# EAGLE design mySatellite (EAGLE 6.6.0)
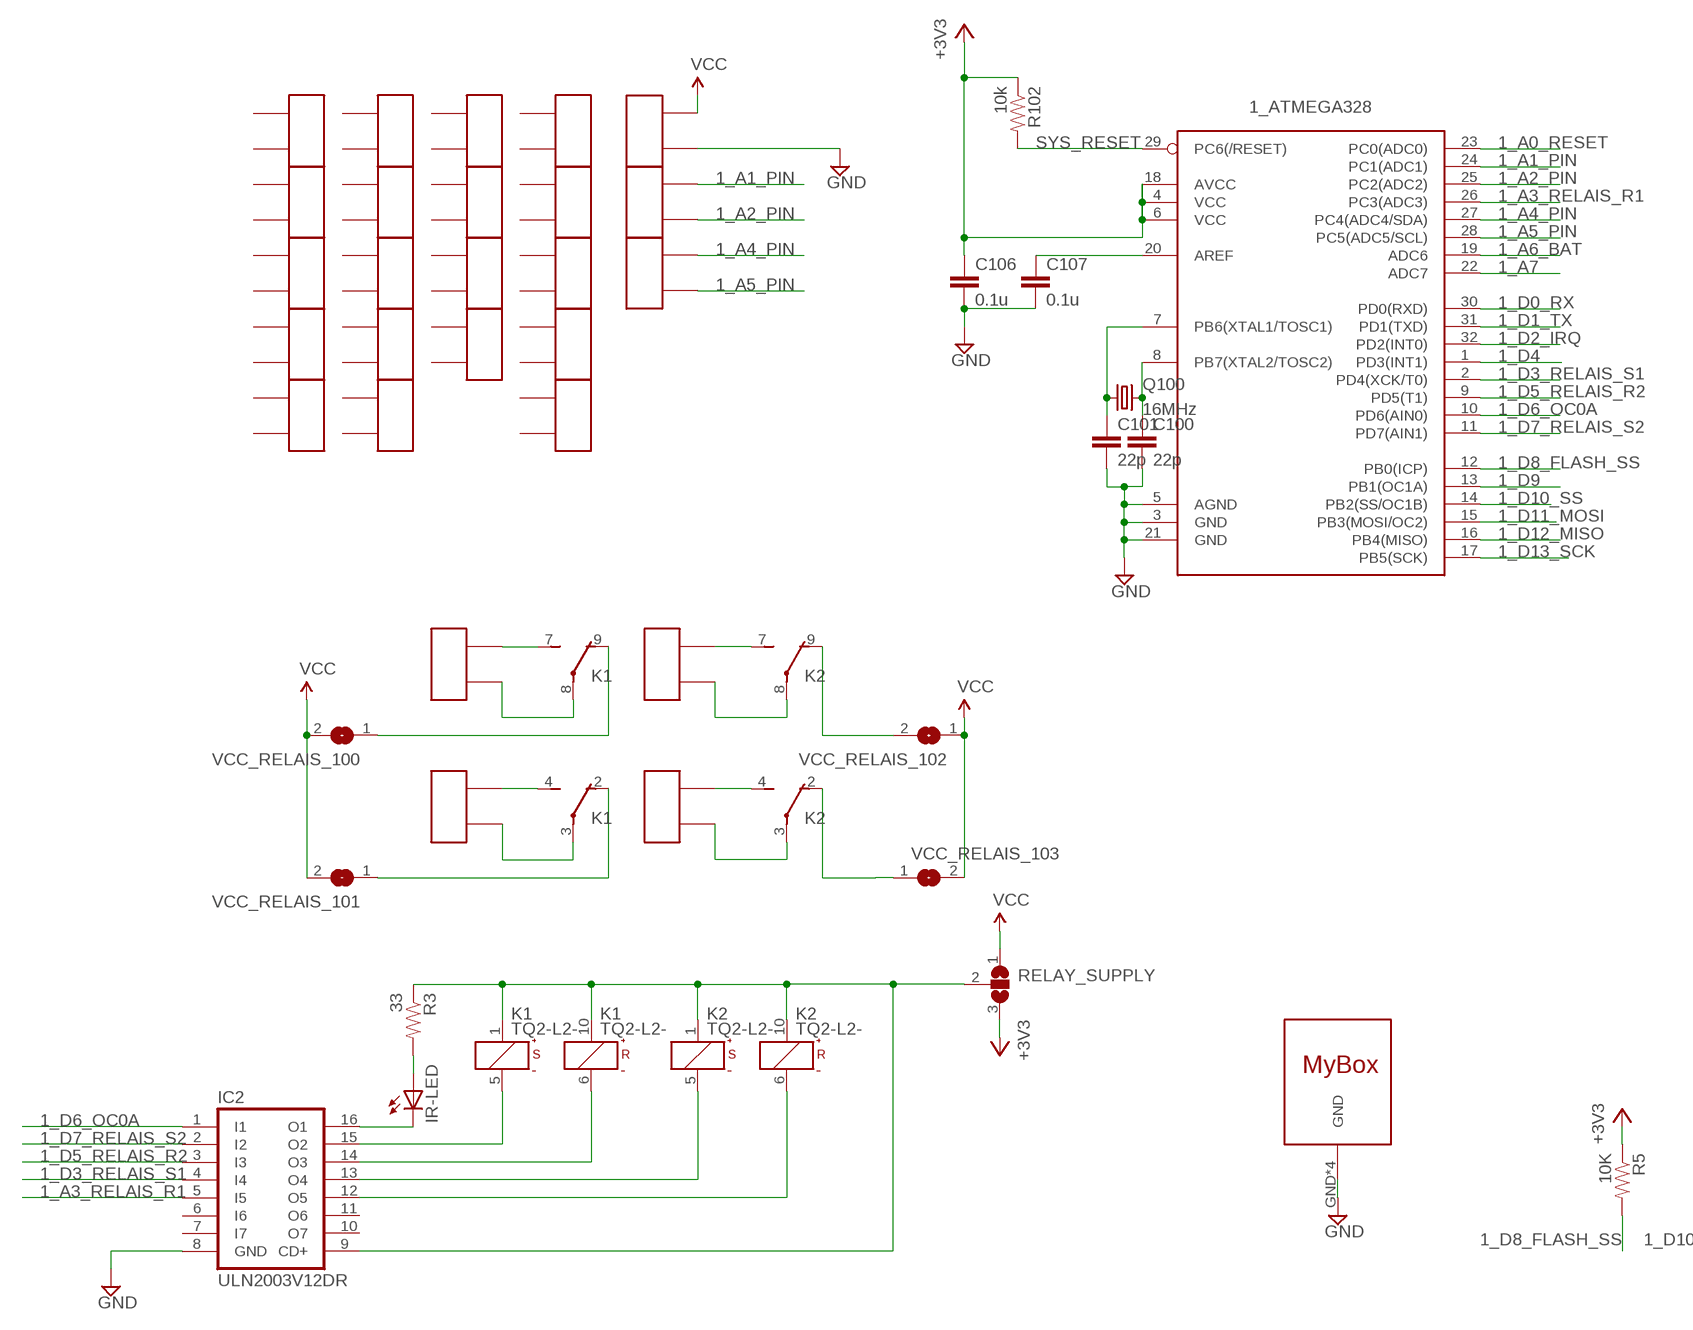
[diagram p0: schematic, sheet 1, part 1 of 2]
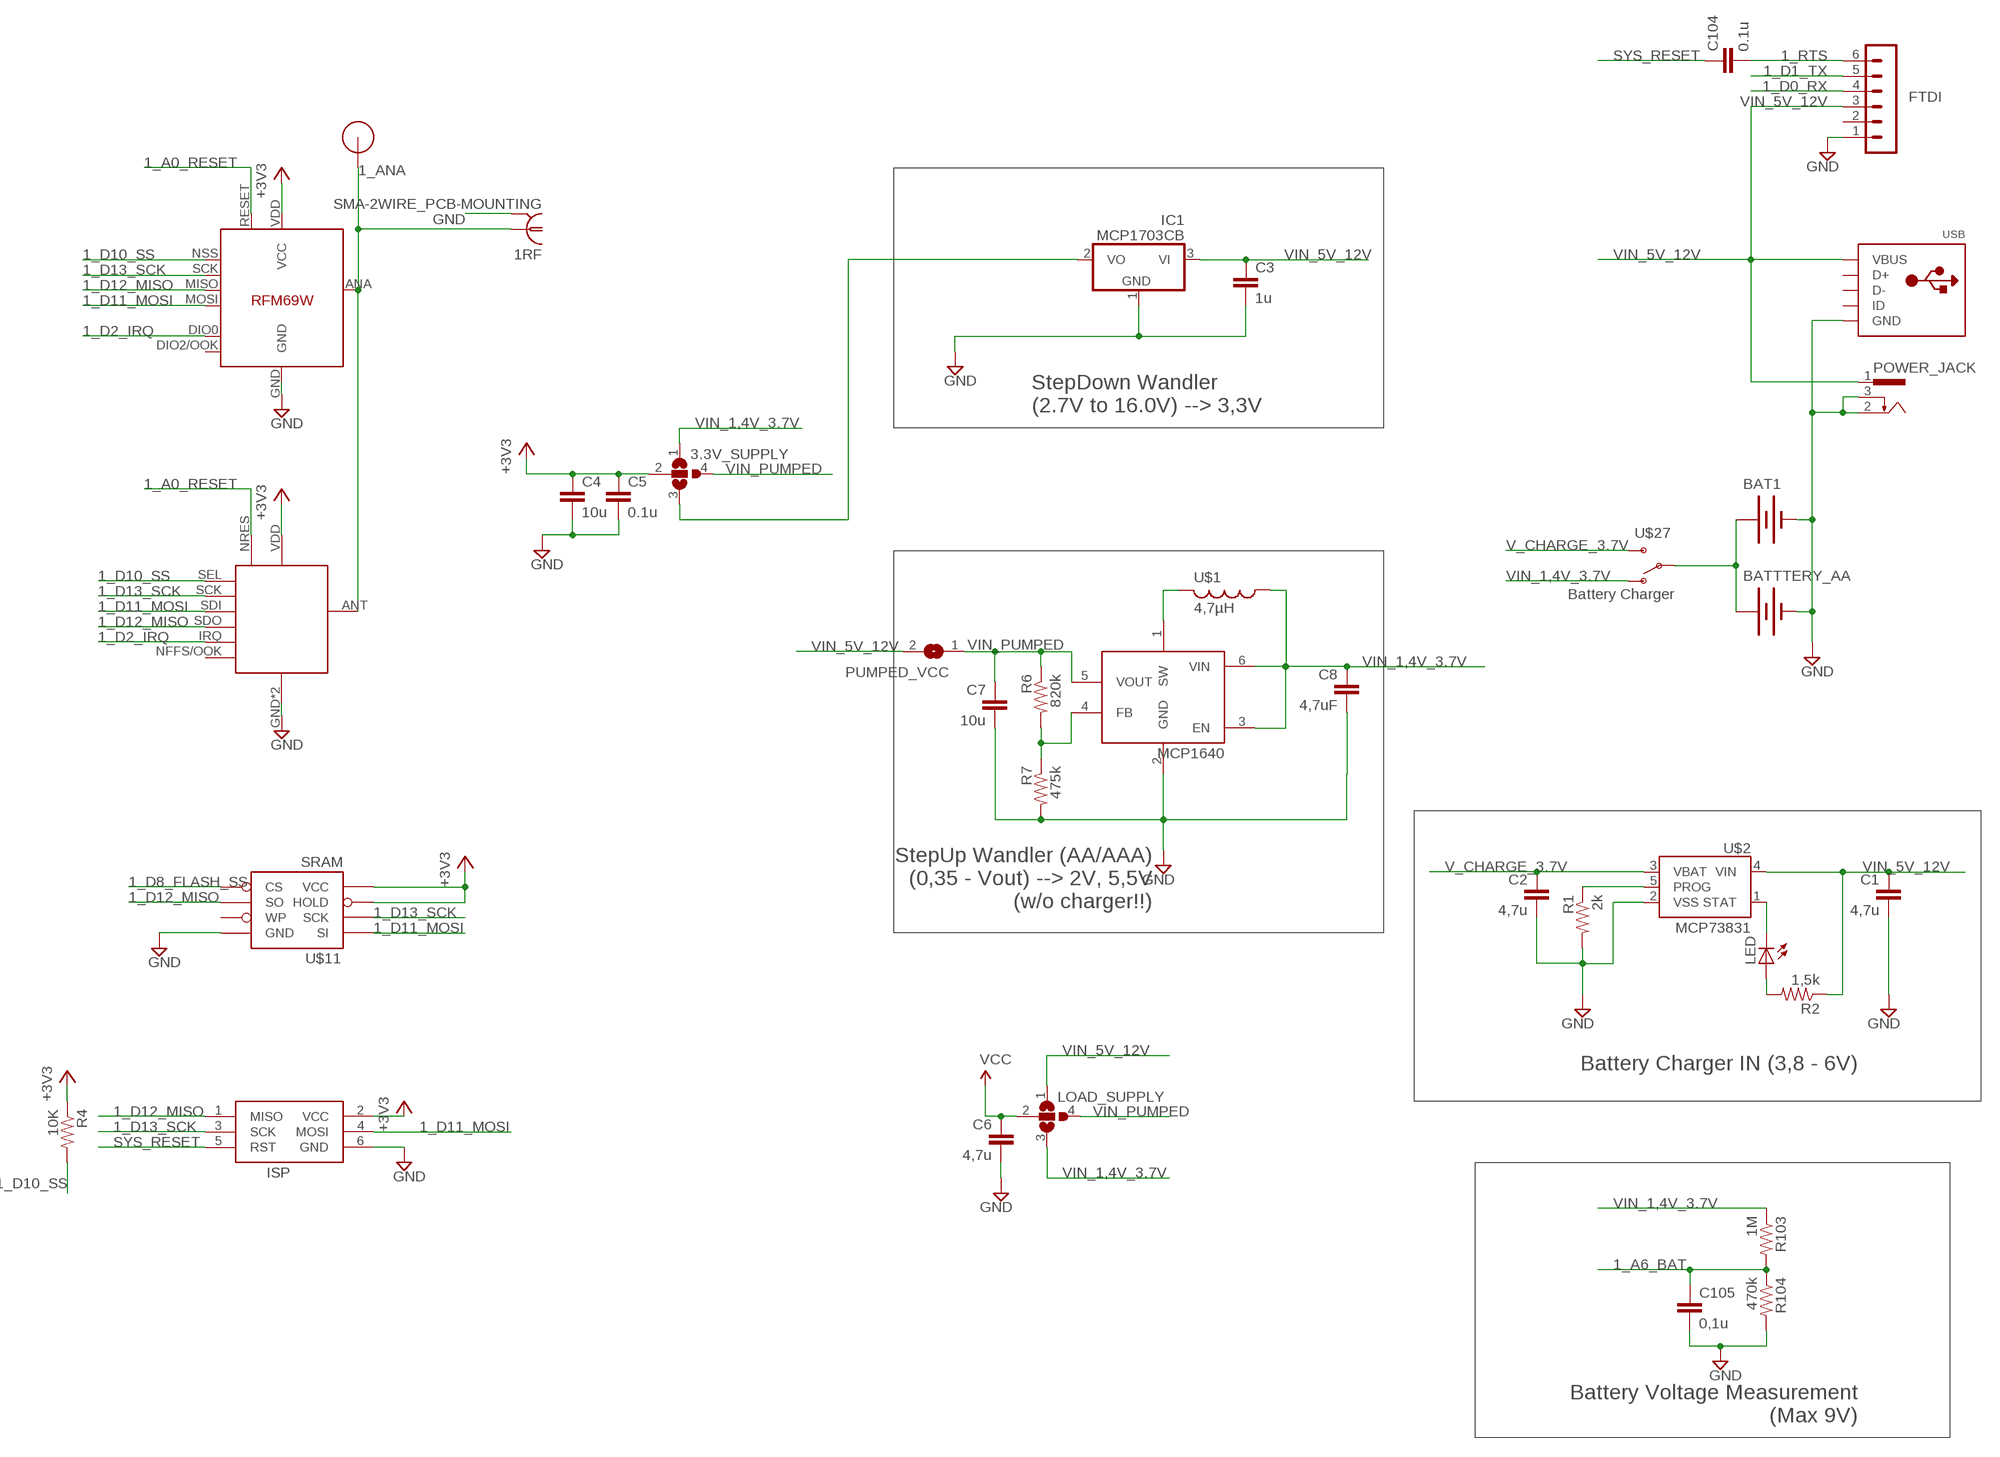
[diagram p1: schematic, sheet 1, part 2 of 2]

## Parts
1_ATMEGA328  ATMega-328  ATMEGA168/328TQFP32  [TQFP32-08]
1_RFM12  RFM12B_MINPADS  [RFM12B-MINPADS]
1_RFM69  RFM69_MINIPADS  [RFM69W-MINPADS]
1RF  SMA-2WIRE_PCB-MOUNTING  [J01151A0931]
3.3V_SUPPLY  SJ3W  [SJ_3]
ADC1  HDR_2PIN  [1X02_NS]
ADC2  HDR_2PIN  [1X02_NS]
BAT1  BATTERY  [BATTERY-CR2]
BATTTERY_AA  BATTERYAA  [BATTERY-AA]
C1  4,7u  CAP0603-CAP  [0603-CAP]
C2  4,7u  CAP0603-CAP  [0603-CAP]
C3  1u  CAP0603-CAP  [0603-CAP]
C4  10u  CAP0603-CAP  [0603-CAP]
C5  0.1u  CAP0603-CAP  [0603-CAP]
C6  4,7u  CAP0603-CAP  [0603-CAP]
C7  10u  CAP0603-CAP  [0603-CAP]
C8  4,7uF  CAP0603-CAP  [0603-CAP]
C100  22p  CAP0603-CAP  [0603-CAP]
C101  22p  CAP0603-CAP  [0603-CAP]
C104  0.1u  CAP0603-CAP  [0603-CAP]
C105  0,1u  CAP0603-CAP  [0603-CAP]
C106  0.1u  CAP0603-CAP  [0603-CAP]
C107  0.1u  CAP0603-CAP  [0603-CAP]
FTDI  FTDI  MA06-1  [MA06-1]
IC1  MCP1703CB  [SOT23]
IC2  ULN2003V12DR  ULN2003AD  [SO16]
IR-LED  LED5MM  [LED5MM]
IR/RELAY_SATELLITE  MY-BOX  [MY-BOX]
ISP  AVRISP  [AVRISP-EDGE]
K1  TQ2-L2-  [TQ2]
K2  TQ2-L2-  [TQ2]
LED  LED3MM  [LED3MM]
LOAD_SUPPLY  SJ3W  [SJ_3]
POWER_JACK  LUMBERG_1613-200-62  [733980-62]
PUMPED_VCC  SJ  [SJ]
Q100  16MHz  CRYSTALHC49S  [HC49/S]
R1  2k  RESISTOR0603-RES  [0603-RES]
R2  1,5k  RESISTOR0603-RES  [0603-RES]
R3  33  RESISTOR0603-RES  [0603-RES]
R4  10K  RESISTOR0603-RES  [0603-RES]
R5  10K  RESISTOR0603-RES  [0603-RES]
R6  820k  RESISTOR0603-RES  [0603-RES]
R7  475k  RESISTOR0603-RES  [0603-RES]
R102  10k  RESISTOR0603-RES  [0603-RES]
R103  1M  RESISTOR0603-RES  [0603-RES]
R104  470k  RESISTOR0603-RES  [0603-RES]
RELAY_SUPPLY  SJ2W  [SJ_2]
U1  MCP1640  [SOT23-6]
U$1  4,7µH  INDUCTOR_B82462G  [INDUCTOR_EPCOS]
U$2  MCP73831  [SOT23-5]
U$3  HDR_2PIN  [1X02_NS]
U$5  HDR_2PIN  [1X02_NS]
U$6  HDR_2PIN  [1X02_NS]
U$7  HDR_2PIN  [1X02_NS]
U$8  HDR_2PIN  [1X02_NS]
U$9  HDR_2PIN  [1X02_NS]
U$10  HDR_2PIN  [1X02_NS]
U$11  SRAM  SRAM_32K256JEDEC_3.9MM  [LOWPOWERLAB_SO08]
U$12  HDR_2PIN  [1X02_NS]
U$13  HDR_2PIN  [1X02_NS]
U$14  HDR_2PIN  [1X02_NS]
U$15  HDR_2PIN  [1X02_NS]
U$16  HDR_2PIN  [1X02_NS]
U$17  HDR_2PIN  [1X02_NS]
U$18  RFM12B_ANTENNA  [RFM12B-ANTENNA]
U$19  HDR_2PIN  [1X02_NS]
U$20  HDR_2PIN  [1X02_NS]
U$21  HDR_2PIN  [1X02_NS]
U$22  HDR_2PIN  [1X02_NS]
U$23  HDR_2PIN  [1X02_NS]
U$24  HDR_2PIN  [1X02_NS]
U$25  HDR_2PIN  [1X02_NS]
U$26  HDR_2PIN  [1X02_NS]
U$27  Battery Charger  SLIDE_SWITCH  [SSK-1202]
U$29  HDR_2PIN  [1X02_NS]
U$30  HDR_2PIN  [1X02_NS]
USB  USBMINIB  [USB-MINIB]
VCC  HDR_2PIN  [1X02_NS]
VCC_RELAIS_100  SJ  [SJ]
VCC_RELAIS_101  SJ  [SJ]
VCC_RELAIS_102  SJ  [SJ]
VCC_RELAIS_103  SJ  [SJ]

## Nets
1_A0_RESET: 1_ATMEGA328.23(PC0(ADC0)) 1_RFM12.NRES 1_RFM69.RESET
1_A1_PIN: 1_ATMEGA328.24(PC1(ADC1)) ADC1.1
1_A2_PIN: 1_ATMEGA328.25(PC2(ADC2)) ADC1.2
1_A3_RELAIS_R1: 1_ATMEGA328.26(PC3(ADC3)) IC2.5(I5)
1_A4_PIN: 1_ATMEGA328.27(PC4(ADC4/SDA)) ADC2.1
1_A5_PIN: 1_ATMEGA328.28(PC5(ADC5/SCL)) ADC2.2
1_A6_BAT: 1_ATMEGA328.19(ADC6) C105.1 R103.2 R104.1
1_A7: 1_ATMEGA328.22(ADC7)
1_ANA [ANT]: 1_RFM12.ANT 1_RFM69.ANA(ANT) 1RF.1 U$18.P$1
1_AREF: 1_ATMEGA328.20(AREF) C107.1
1_D0_RX: 1_ATMEGA328.30(PD0(RXD)) FTDI.4
1_D1_TX: 1_ATMEGA328.31(PD1(TXD)) FTDI.5
1_D2_IRQ: 1_ATMEGA328.32(PD2(INT0)) 1_RFM12.IRQ 1_RFM69.DIO0(DIO0/IRQ)
1_D3_RELAIS_S1: 1_ATMEGA328.2(PD4(XCK/T0)) IC2.4(I4)
1_D4: 1_ATMEGA328.1(PD3(INT1))
1_D5_RELAIS_R2: 1_ATMEGA328.9(PD5(T1)) IC2.3(I3)
1_D6_OC0A: 1_ATMEGA328.10(PD6(AIN0)) IC2.1(I1)
1_D7_RELAIS_S2: 1_ATMEGA328.11(PD7(AIN1)) IC2.2(I2)
1_D8_FLASH_SS: 1_ATMEGA328.12(PB0(ICP)) R5.2 U$11.1_CS(CS)
1_D9: 1_ATMEGA328.13(PB1(OC1A))
1_D10_SS: 1_ATMEGA328.14(PB2(SS/OC1B)) 1_RFM12.SEL 1_RFM69.NSS(SEL) R4.2
1_D11_MOSI: 1_ATMEGA328.15(PB3(MOSI/OC2)) 1_RFM12.SDI(SDI/MOSI) 1_RFM69.MOSI ISP.4(MOSI) U$11.5_SI(SI)
1_D12_MISO: 1_ATMEGA328.16(PB4(MISO)) 1_RFM12.SDO(SDO/MISO) 1_RFM69.MISO ISP.1(MISO) U$11.2_SO(SO)
1_D13_SCK: 1_ATMEGA328.17(PB5(SCK)) 1_RFM12.SCK 1_RFM69.SCK ISP.3(SCK) U$11.6_SCK(SCK)
1_RTS: C104.2 FTDI.6
+3V3 [power]: 1_ATMEGA328.4(VCC) 1_ATMEGA328.6(VCC) 1_ATMEGA328.18(AVCC) 1_RFM12.VDD 1_RFM69.VDD(VCC) 3.3V_SUPPLY.2 C4.1 C5.1 C106.1 ISP.2(VCC) R4.1 R5.1 R102.1 RELAY_SUPPLY.3 U$11.7_HOLD(HOLD) U$11.8_VCC(VCC)
BAT+ [power]: BAT1.PWR@1(+) BATTTERY_AA.PWR@1(+) U$27.P
GND [power]: 1_ATMEGA328.3(GND) 1_ATMEGA328.5(AGND) 1_ATMEGA328.21(GND) 1_RFM12.GND 1_RFM12.GND1(GND) 1_RFM69.GND 1RF.G@1 1RF.G@2 1RF.G@3 1RF.G@4 BAT1.GND@1(-) BATTTERY_AA.GND@1(-) C1.2 C2.2 C3.2 C4.2 C5.2 C6.2 C7.2 C8.2 C100.2 C101.2 C105.2 C106.2 C107.2 FTDI.1 IC1.1(GND) IC2.8(GND) IR/RELAY_SATELLITE.GND IR/RELAY_SATELLITE.GND1(GND) IR/RELAY_SATELLITE.GND2(GND) IR/RELAY_SATELLITE.GND3(GND) ISP.6(GND) POWER_JACK.2 POWER_JACK.3 R1.2 R7.2 R104.2 U1.2(GND) U$2.2(VSS) U$11.4_GND(GND) USB.GND VCC.2
N$1: 1_ATMEGA328.7(PB6(XTAL1/TOSC1)) C101.1 Q100.1
N$2: R1.1 U$2.5(PROG)
N$3 [power]: IR-LED.A R3.2
N$4 [power]: IC2.16(O1) IR-LED.K(C)
N$5 [power]: IC2.15(O2) K1.5(S:-)
N$6 [power]: IC2.14(O3) K1.6(R:-)
N$7: 1_ATMEGA328.8(PB7(XTAL2/TOSC2)) C100.1 Q100.2
N$8: LED.K(C) U$2.1(STAT)
N$9 [power]: 3.3V_SUPPLY.3 IC1.2(VO)
N$10 [high_power]: K2.3(1:P) U$24.1
N$11: LED.A R2.2
N$12 [high_power]: K1.4(1:S) U$22.2
N$13 [high_power]: K1.8(2:P) U$21.1
N$14 [high_power]: K1.7(2:S) U$21.2
N$15 [power]: IC2.13(O4) K2.5(S:-)
N$16 [power]: IC2.12(O5) K2.6(R:-)
N$17 [high_power]: K2.8(2:P) U$23.1
N$18 [high_power]: K2.4(1:S) U$24.2
N$19 [high_power]: K2.7(2:S) U$23.2
N$20 [high_power]: K1.3(1:P) U$22.1
N$21 [high_power]: K1.2(1:O) VCC_RELAIS_101.1
N$23 [power]: IC2.9(CD+) K1.1(S:+) K1.10(R:+) K2.1(S:+) K2.10(R:+) R3.1 RELAY_SUPPLY.2
N$24 [high_power]: K2.2(1:O) VCC_RELAIS_103.1
N$25 [high_power]: K1.9(2:O) VCC_RELAIS_100.1
N$26 [high_power]: K2.9(2:O) VCC_RELAIS_102.2
N$27 [power]: U1.1(SW) U$1.P$2
N$29 [power]: R6.2 R7.1 U1.4(FB)
SYS_RESET: 1_ATMEGA328.29(PC6(/RESET)) C104.1 ISP.5(RST) R102.2
V_CHARGE_3.7V [power]: C2.1 U$2.3(VBAT) U$27.S
VCC [high_power]: C6.1 LOAD_SUPPLY.2 RELAY_SUPPLY.1 VCC.1 VCC_RELAIS_100.2 VCC_RELAIS_101.2 VCC_RELAIS_102.1 VCC_RELAIS_103.2
VIN_1,4V_3.7V [power]: 3.3V_SUPPLY.1 C8.1 LOAD_SUPPLY.3 R103.1 U1.3(EN) U1.6(VIN) U$1.P$1 U$27.O
VIN_5V_12V [high_power]: C1.1 C3.1 FTDI.3 IC1.3(VI) LOAD_SUPPLY.1 POWER_JACK.1 PUMPED_VCC.2 R2.1 U$2.4(VIN) USB.VBUS
VIN_PUMPED [power]: 3.3V_SUPPLY.4 C7.1 LOAD_SUPPLY.4 PUMPED_VCC.1 R6.1 U1.5(VOUT)
Unconnected: 1_RFM12.NFFS/OOK 1_RFM69.DIO2/OOK FTDI.2 IC2.6(I6) IC2.7(I7) IC2.10(O7) IC2.11(O6) U$3.1 U$3.2 U$5.1 U$5.2 U$6.1 U$6.2 U$7.1 U$7.2 U$8.1 U$8.2 U$9.1 U$9.2 U$10.1 U$10.2 U$11.3_WP(WP) U$12.1 U$12.2 U$13.1 U$13.2 U$14.1 U$14.2 U$15.1 U$15.2 U$16.1 U$16.2 U$17.1 U$17.2 U$19.1 U$19.2 U$20.1 U$20.2 U$25.1 U$25.2 U$26.1 U$26.2 U$29.1 U$29.2 U$30.1 U$30.2 USB.D+ USB.D- USB.ID

## Notes on the sheet
- StepDown Wandler 
  (2.7V to 16.0V) --> 3,3V
- StepUp Wandler (AA/AAA)
  (0,35 - Vout) --> 2V, 5,5V
  (w/o charger!!)
- Battery Charger IN (3,8 - 6V)
- Battery Voltage Measurement
  (Max 9V)

## Library data of the parts
1_ATMEGA328 = myLib:ATMEGA168/328: Atmel 32-pin 8-bit micro, 16k flash.; BUERKLIN: 64 S 3046; CONRAD: 155196 - 62
1_RFM12 = myLib:RFM12B_MINPADS
1_RFM69 = myLib:RFM69_MINIPADS
1RF = myLib:SMA-2WIRE_PCB-MOUNTING: SMA 50 Ohm Straight Jack Receptacle - PCB Mountung www.telegaertner.de Source: Buerklin Artikelnummer: J01151A0931; BUERKLIN: 76F410
3.3V_SUPPLY LOAD_SUPPLY = myLib:SJ3W: SMD solder JUMPER
ADC1 ADC2 U$3 U$5-U$10 U$12-U$17 U$19-U$26 U$29 U$30 VCC = myLib:HDR_2PIN
BAT1 = myLib:BATTERY: Battery Holders Various common sizes : AA, AAA, 20mm coin cell and 12mm coin cell.
BATTTERY_AA = myLib:BATTERY: Battery Holders Various common sizes : AA, AAA, 20mm coin cell and 12mm coin cell.; CONRAD: 651036 - 62
C1 C2 C8 = LowPowerLab:CAP: Capacitor Standard 0603 ceramic capacitor, and 0.1" leaded capacitor.; BUERKLIN: 53 D 2086
C3 = LowPowerLab:CAP: Capacitor Standard 0603 ceramic capacitor, and 0.1" leaded capacitor.; BUERKLIN: 53 D 2082
C4 C7 = LowPowerLab:CAP: Capacitor Standard 0603 ceramic capacitor, and 0.1" leaded capacitor.; BUERKLIN: 53 D 1652
C5 C104-C107 = LowPowerLab:CAP: Capacitor Standard 0603 ceramic capacitor, and 0.1" leaded capacitor.; BUERKLIN: 53 D 1726
C6 = LowPowerLab:CAP: Capacitor Standard 0603 ceramic capacitor, and 0.1" leaded capacitor.; BUERKLIN: 53 D 1659
C100 C101 = LowPowerLab:CAP: Capacitor Standard 0603 ceramic capacitor, and 0.1" leaded capacitor.; BUERKLIN: 53 D 1676
FTDI = JeeLabs:MA06-1: PIN HEADER; BUERKLIN: 59 F 2134
IC1 = linear:MCP1703: 250 mA, 16V, Low Quiescent Current LDO Regulator Source: http://ww1.microchip.com/downloads/en/DeviceDoc/22049b.pdf; CONRAD: 651422 - 62
IC2 = uln-udn:ULN2003A: DRIVER ARRAY; CONRAD: 1187534 - 62
IR-LED = led:LED: LED; BUERKLIN: 65 S 2292
IR/RELAY_SATELLITE = myLib:MY-BOX; CONRAD: 522651
ISP = myLib:AVRISP: AVR ISP HEADER Standard 6 pin header for AVR programming; BUERKLIN: 56F6228; CONRAD: 737480-62
K1 K2 = relay:TQ2?-L2-*: LOW PROFILE 2 FORM C RELAY NAiS 2 coil latching Source: http://www.mew-europe.com/.. en_ds_61020_0001.pdf Source: http://www.mew-europe.com/.. en_ds_61020_0002.pdf; BUERKLIN: 30 G 7570; MF: AROMAT/ MATSUSHITA; MPN: TQ2-L2-3V; OC_FARNELL: 1217662; OC_NEWARK: 64K3196
LED = adafruit:LED: LED; CONRAD: 1050451 - 62
POWER_JACK = myLib:LUMBERG_1613-20: FEMALE PRINT CONNECTOR Niedervolt-Steckverbinder Distributor Conrad; BUERKLIN: 40 F 144
PUMPED_VCC VCC_RELAIS_100-VCC_RELAIS_103 = jumper:SJ: SMD solder JUMPER
Q100 = crystal:CRYSTAL: CRYSTAL; BUERKLIN: 78D428; OC_FARNELL: 1667008; OC_NEWARK: unknown
R1 = LowPowerLab:RESISTOR: Resistor Basic schematic elements and footprints for 0603, 1206, and PTH resistors.; BUERKLIN: 26 E 7099
R2 = LowPowerLab:RESISTOR: Resistor Basic schematic elements and footprints for 0603, 1206, and PTH resistors.; BUERKLIN: 26 E 796
R3 = LowPowerLab:RESISTOR: Resistor Basic schematic elements and footprints for 0603, 1206, and PTH resistors.; BUERKLIN: 26 E 756
R4 R5 R102 = LowPowerLab:RESISTOR: Resistor Basic schematic elements and footprints for 0603, 1206, and PTH resistors.; BUERKLIN: 26 E 816
R6 = LowPowerLab:RESISTOR: Resistor Basic schematic elements and footprints for 0603, 1206, and PTH resistors.; BUERKLIN: 26 E 862
R7 = LowPowerLab:RESISTOR: Resistor Basic schematic elements and footprints for 0603, 1206, and PTH resistors.; BUERKLIN: 26 E 7201
R103 = LowPowerLab:RESISTOR: Resistor Basic schematic elements and footprints for 0603, 1206, and PTH resistors.; BUERKLIN: 26 E 864
R104 = LowPowerLab:RESISTOR: Resistor Basic schematic elements and footprints for 0603, 1206, and PTH resistors.; BUERKLIN: 26 E 856
RELAY_SUPPLY = myLib:SJ2W: SMD solder JUMPER
U1 = myLib:MCP1640: MCP1623, 1624, 1640/B/C/D pwm/pfm or pwm only DC/DC converters, in SOT-23; CONRAD-MCP1640C: 651406 - 62
U$1 = myLib:INDUCTOR; BUERKLIN_EPCOS: 73 D 9010
U$2 = myLib:MCP73831: Microchip's MCP73831 Miniature single cell, fully integrated Li-Ion, Li-polymer charge management controller http://ww1.microchip.com/downloads/en/DeviceDoc/21984a.pdf; CONRAD: 651522 - 62
U$11 = myLib:SRAM_32K256: 4-Mbit SPI flash memory; CONRAD: 651216 - 62
U$18 = LowPowerLab:RFM12B_ANTENNA
U$27 = myLib:SLIDE_SWITCH: Side-actuated SPDT slide switch, as used on the Arduino Pro; CONRAD: 709774 - 62
USB = myLib:USB: USB Connectors USBMINIB - Surface Mount Female Mini-B USB Connector 4UConnector: 06564 By microbuilder.eu Thru-hole RA Female Mini-B USB Connector 4UConnector: 18732 By ladyada.net; BUERKLIN: 72 F 2280

## Net classes
1 power: width 0.356 mm, clearance 0.229 mm
2 ANT: width 0.381 mm, clearance 0.254 mm
3 high_power: width 0.508 mm, clearance 0.381 mm

## Board
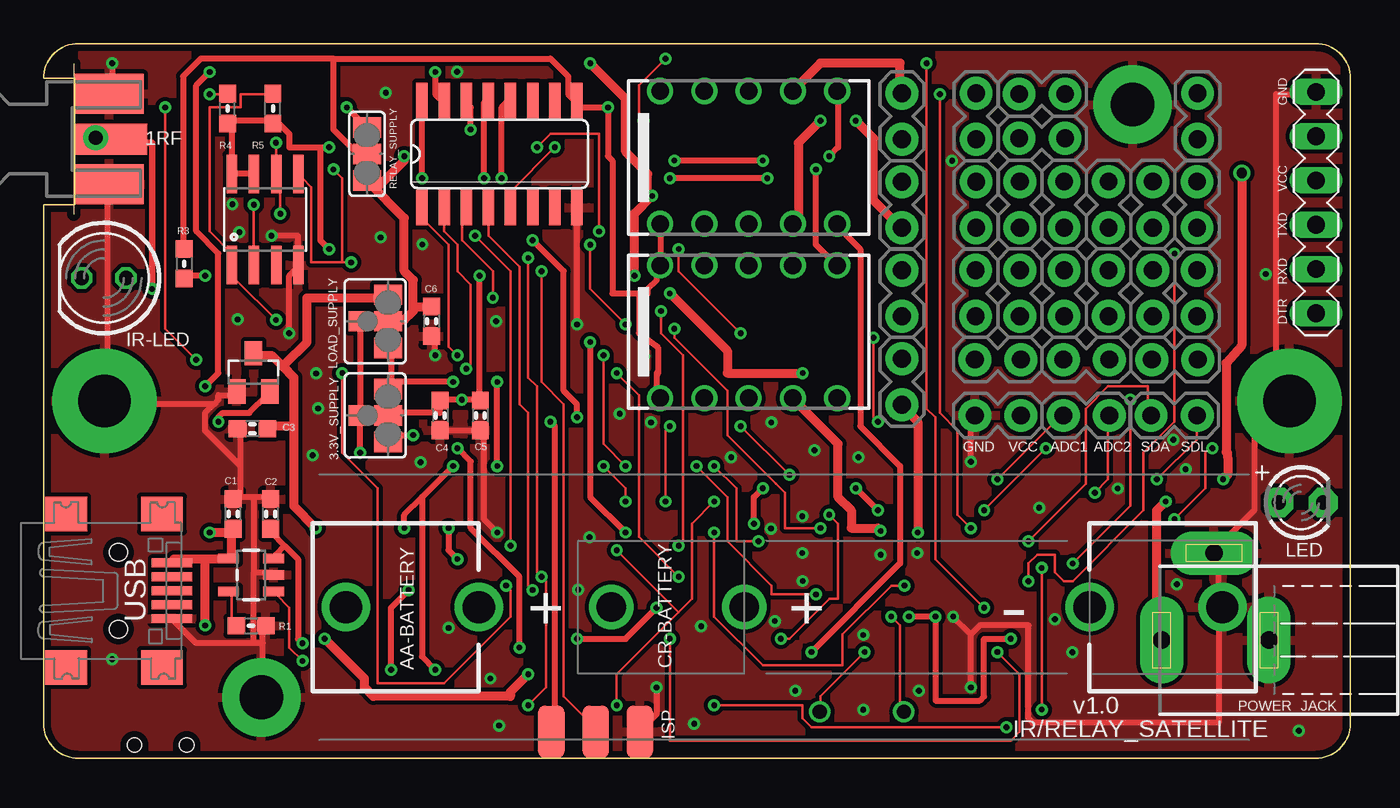
[diagram p2: board, top side]
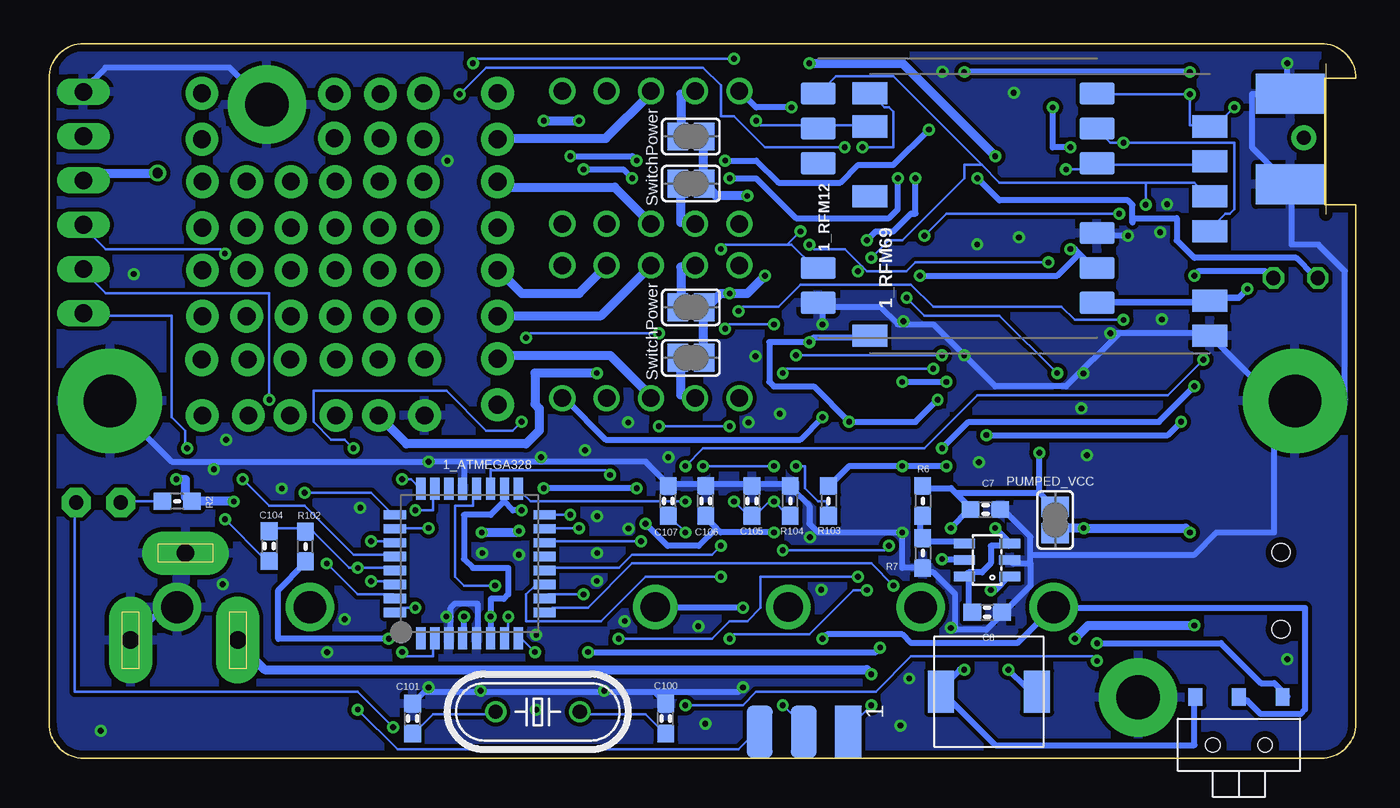
[diagram p3: board, bottom side, seen from below]

Size 75 x 41 mm. Coordinates in mm from the lower left corner, seen from the top.
Copper layers (1*16): Top 0.0356mm / dielectric 1.5011mm / Bottom 0.0356mm
Design rules "LaenPCBOrder": minimum track width 6mil, minimum drill 13mil, track to track 6mil, track to pad 6mil, pad to pad 6mil, via to via 6mil, smd to smd 6mil, copper to edge 15mil, drill to drill 6mil, minimum pad ring 7mil, minimum via ring 7mil, stop-mask expansion 3mil, vias tented up to drill 0mil, thermal gap 10mil

### Footprints (pad centres in the part's own frame; a part is rotated, then mirrored left to right if it is on the bottom)
TQFP32-08 = smd 1.27 x 0.533: 1 -4.293,2.8; 2 -4.293,2; 3 -4.293,1.2; 4 -4.293,0.4; 5 -4.293,-0.4; 6 -4.293,-1.2; 7 -4.293,-2; 8 -4.293,-2.8; 17 4.293,-2.8; 18 4.293,-2; 19 4.293,-1.2; 20 4.293,-0.4; 21 4.293,0.4; 22 4.293,1.2; 23 4.293,2; 24 4.293,2.8 | smd 0.533 x 1.27: 9 -2.8,-4.293; 10 -2,-4.293; 11 -1.2,-4.293; 12 -0.4,-4.293; 13 0.4,-4.293; 14 1.2,-4.293; 15 2,-4.293; 16 2.8,-4.293; 25 2.8,4.293; 26 2,4.293; 27 1.2,4.293; 28 0.4,4.293; 29 -0.4,4.293; 30 -1.2,4.293; 31 -2,4.293; 32 -2.8,4.293
RFM12B-MINPADS = smd 2 x 1.27: ANT 8,-6; GND 8,-2; GND1 -8.002,-6.001; IRQ -8,4; NFFS/OOK -8,2; NRES -8.002,-4; SCK 8,4; SDI 8,2; SDO -8,6; SEL 8,6; VDD 8,-4
RFM69W-MINPADS = smd 2 x 1.27: ANA 8,-5; DIO0 -11.5,5; DIO2/OOK -11.5,1; GND 8,-7; MISO 8,1; MOSI 8,3; NSS 8,5; RESET -11.5,6.909; SCK 8,-1; VDD -11.5,-7
J01151A0931 = smd 4.191 x 1.778: 1 2.134,0 | smd 3.937 x 2.286: G@1 2.032,2.6; G@2 2.032,-2.6 | smd 3.937 x 2.286 bottom: G@3 2.032,2.6; G@4 2.032,-2.6
SJ_3 = smd 1.168 x 1.6: 1 -1.524,0; 2 0,0; 3 1.524,0 | smd 1.168 x 1.168: 4 0,-1.67
1X02_NS = drill 1.016 pad 1.88: 1 -1.321,0; 2 1.321,0
BATTERY-CR2 = drill 1.702: GND@1 17.272,0; GND@2 9.652,0; PWR@1 -10.16,0; PWR@2 -17.78,0
BATTERY-AA = drill 1.854: GND@1 25.146,0; GND@2 17.526,0; PWR@1 -25.146,0; PWR@2 -17.526,0
0603-CAP = smd 1.016 x 0.965: 1 -0.85,0; 2 0.85,0
MA06-1 = drill 1.016 long: 1 0,0; 2 2.54,0; 3 5.08,0; 4 7.62,0; 5 10.16,0; 6 12.7,0
SOT23 = smd 1 x 1.4: 1 -0.95,-1.1; 2 0.95,-1.1; 3 0,1.1
SO16 = smd 0.66 x 2.032: 1 -4.445,-3.073; 2 -3.175,-3.073; 3 -1.905,-3.073; 4 -0.635,-3.073; 5 0.635,-3.073; 6 1.905,-3.073; 7 3.175,-3.073; 8 4.445,-3.073; 9 4.445,3.073; 10 3.175,3.073; 11 1.905,3.073; 12 0.635,3.073; 13 -0.635,3.073; 14 -1.905,3.073; 15 -3.175,3.073; 16 -4.445,3.073
LED5MM = drill 0.813 octagon: A -1.27,0; K 1.27,0
MY-BOX = drill 2.5 pad 4.5: GND 12.5,3.5; GND1 62.5,37.5 | drill 3 pad 6: GND2 3.5,20.5; GND3 71.5,20.5
AVRISP-EDGE = smd 3 x 1.5: 1 1.5,2.54; 3 1.5,0; 5 1.5,-2.54 | smd 3 x 1.5 bottom: 2 1.5,2.54; 4 1.5,0; 6 1.5,-2.54
TQ2 = drill 1: 1 -5.08,-3.81; 2 -2.54,-3.81; 3 0,-3.81; 4 2.54,-3.81; 5 5.08,-3.81; 6 5.08,3.81; 7 2.54,3.81; 8 0,3.81; 9 -2.54,3.81; 10 -5.08,3.81
LED3MM = drill 0.813 pad 1.676 octagon: A -1.27,0; K 1.27,0
733980-62 = drill 1 pad 2.5 long: 1 0,8.57; 2 0,2.42; 3 5,5.57
SJ = smd 1.168 x 1.6: 1 -0.762,0; 2 0.762,0
HC49/S = drill 0.813: 1 -2.413,0; 2 2.413,0
0603-RES = smd 1.016 x 0.965: 1 -0.85,0; 2 0.85,0
SJ_2 = smd 1.168 x 1.6: 1 -1.524,0; 2 0,0; 3 1.524,0
SOT23-6 = smd 0.55 x 1.2: 1 -0.95,-1.3; 2 0,-1.3; 3 0.95,-1.3; 4 0.95,1.3; 5 0,1.3; 6 -0.95,1.3
INDUCTOR_EPCOS = smd 1.5 x 2.4: P$1 -2.75,3.15; P$2 2.75,3.15
SOT23-5 = smd 0.55 x 1.2: 1 -0.95,-1.3; 2 0,-1.3; 3 0.95,-1.3; 4 0.95,1.3; 5 -0.95,1.3
LOWPOWERLAB_SO08 = smd 0.61 x 2.21: 1_CS -1.905,-2.616; 2_SO -0.635,-2.616; 3_WP 0.635,-2.616; 4_GND 1.905,-2.616; 5_SI 1.905,2.616; 6_SCK 0.635,2.616; 7_HOLD -0.635,2.616; 8_VCC -1.905,2.616
RFM12B-ANTENNA = drill 0.8 pad 1.422: P$1 0,0
SSK-1202 = smd 0.8 x 1: O -2.5,2.75; P 0,2.75; S 2.5,2.75 | hole 0.8: -1.5,0; 1.5,0
USB-MINIB = smd 0.5 x 2.308: D+ 0,4.064; D- -0.8,4.064; GND 1.6,4.064; ID 0.8,4.064; VBUS -1.6,4.064 | smd 2 x 2.4: GND1 -4.4,-2; GND2 -4.4,3.5; GND3 4.4,3.5; GND4 4.4,-2 | hole 1: -2.2,1; 2.2,1

### Placement (x,y rotation side)
1_ATMEGA328  50.86,11.17 90 bottom
1_RFM12  22.86,32.13 0 bottom
1_RFM69  16.38,31.24 0 bottom
1RF  1.73,35.52 0 top
3.3V_SUPPLY  19.76,19.67 270 top
ADC1  59.84,19.67 0 top
ADC2  64.88,19.67 0 top
BAT1  50.36,8.67 0 top
BATTTERY_AA  42.5,8.67 0 top
C1  10.88,14.02 90 top
C2  13.03,14.02 90 top
C3  11.99,18.91 180 top
C4  22.76,19.67 270 top
C5  25.06,19.67 270 top
C6  22.26,25.07 270 top
C7  21.26,14.27 0 bottom
C8  21.16,8.37 0 bottom
C100  39.61,2.27 90 bottom
C101  54.13,2.27 90 bottom
C104  62.36,12.17 270 bottom
C105  34.66,14.77 90 bottom
C106  37.31,14.77 90 bottom
C107  39.46,14.77 90 bottom
FTDI  73.02,38.23 270 top
IC1  12.04,22.13 0 top
IC2  26.16,34.67 0 top
IR-LED  3.46,27.55 180 top
IR/RELAY_SATELLITE  0,0 0 top
ISP  31.68,3.03 270 bottom
K1  40.46,34.47 0 top
K2  40.46,24.47 0 top
LED  72.16,14.67 0 top
LOAD_SUPPLY  19.76,25.07 270 top
POWER_JACK  72.74,6.78 90 top
PUMPED_VCC  17.26,13.67 270 bottom
Q100  46.95,2.67 0 bottom
R1  11.91,7.59 0 top
R2  67.64,14.74 180 bottom
R3  8.06,28.37 270 top
R4  10.56,37.27 90 top
R5  13.16,37.27 90 top
R6  24.86,14.77 270 bottom
R7  24.86,11.77 270 bottom
R102  60.28,12.15 90 bottom
R103  30.26,14.77 270 bottom
R104  32.46,14.77 90 bottom
RELAY_SUPPLY  18.56,34.67 90 top
U1  21.16,11.37 90 bottom
U$1  21.06,0.67 0 bottom
U$2  11.91,10.52 90 top
U$3  59.84,22.87 180 top
U$5  56.03,26.68 270 top
U$6  58.57,26.68 270 top
U$7  61.11,26.68 270 top
U$8  63.65,26.68 270 top
U$9  66.19,26.68 270 top
U$10  53.49,26.68 270 top
U$11  12.72,30.91 0 top
U$12  56.03,31.76 270 top
U$13  58.57,31.76 270 top
U$14  61.11,31.76 270 top
U$15  63.65,31.76 270 top
U$16  66.19,31.76 270 top
U$17  53.52,31.75 270 top
U$18  3,35.6 0 top
U$19  57.3,35.57 180 top
U$20  64.92,22.87 180 top
U$21  49.26,36.83 90 top
U$22  49.26,31.75 270 top
U$23  49.26,26.68 90 top
U$24  49.26,21.6 270 top
U$25  57.3,38.11 180 top
U$26  54.76,22.87 180 top
U$27  6.71,0.77 0 bottom
U$29  66.22,36.83 90 top
U$30  53.52,36.83 90 top
USB  3.3,9.61 270 top
VCC  54.76,19.67 180 top
VCC_RELAIS_100  38.16,35.67 0 bottom
VCC_RELAIS_101  38.16,32.97 0 bottom
VCC_RELAIS_102  38.16,25.87 180 bottom
VCC_RELAIS_103  38.16,22.97 0 bottom

### Tracks (layer width: path | path; a pad name or v marks a point on that pad's centre or on a via)
1_A0_RESET  (via drill 0.33)
  Top 0.152: v57.53,17.78 v53.98,14.22 | v47.88,19.3 47.62,19.56 v47.62,24.13 | v40.01,24.38 36.45,27.94 v36.45,29.21 | v28.32,35.05 29.08,35.81 31.88,35.81 v31.88,30.23
  Bottom 0.152: v53.98,14.22 52.96,14.22 52.96,15.24 1_ATMEGA328.23 | v57.53,17.78 58.04,18.29 58.8,18.29 59.82,19.3 59.82,21.08 52.2,21.08 49.91,18.8 48.39,18.8 v47.88,19.3 | v47.62,24.13 47.37,24.38 v40.01,24.38 | v36.45,29.21 36.2,29.46 32.64,29.46 | 32.64,29.46 32.39,29.46 31.11,28.19 1_RFM12.NRES | v28.32,35.05 26.54,35.05 26.54,37.08 26.8,37.34 27.05,37.34 27.81,38.1 1_RFM69.RESET | 32.64,29.46 v31.88,30.23
1_A1_PIN  (via drill 0.33)
  Top 0.152: v54.74,16 58.29,19.56 ADC1.1
  Bottom 0.152: v54.74,16 54.23,16 53.72,15.49 1_ATMEGA328.24
1_A2_PIN  (via drill 0.33)
  Top 0.152: v60.32,15.24 61.09,16 61.09,19.56 ADC1.2
  Bottom 0.152: v60.32,15.24 56.52,15.24 55.25,13.97 1_ATMEGA328.25
1_A3_RELAIS_R1  (via drill 0.33)
  Top 0.152: v53.21,13.21 52.45,13.97 52.45,18.8 51.44,19.81 v51.44,38.1 | v29.34,35.05 26.8,32.51 26.8,31.75 IC2.5
  Bottom 0.152: v53.21,13.21 54.99,13.21 1_ATMEGA328.26 | v51.44,38.1 49.91,39.62 37.47,39.62 36.45,38.61 36.45,36.83 35.69,36.83 33.91,35.05 v29.34,35.05
1_A4_PIN  (via drill 0.33)
  Top 0.152: v56.52,12.45 59.82,15.75 59.82,20.07 61.09,21.34 63.37,21.34 63.37,19.81 ADC2.1
  Bottom 0.152: v56.52,12.45 55.25,12.45 1_ATMEGA328.27
1_A5_PIN  (via drill 0.33)
  Top 0.152: v63.88,16 66.17,18.29 66.17,19.56 ADC2.2
  Bottom 0.152: v63.88,16 62.36,14.48 60.32,14.48 57.53,11.68 55.25,11.68 1_ATMEGA328.28
1_A6_BAT  (via drill 0.33)
  Top 0.152: v32.13,16.76 33.4,15.49 v33.4,14.73 | v40.01,19.05 v42.8,16.26 | v35.94,19.05 35.69,18.8 v35.69,14.73
  Bottom 0.152: v32.13,16.76 31.62,16.76 31.62,15.49 30.86,14.73 30.35,14.73 30.35,13.97 R103.2 | R104.1 32.64,13.97 v33.4,14.73 33.66,14.73 34.42,13.97 C105.1 34.67,13.97 34.93,13.97 v35.69,14.73 | v42.8,16.26 43.05,16.51 49.66,16.51 49.66,15.49 1_ATMEGA328.19 | v35.94,19.05 v40.01,19.05
1_ANA  (via drill 0.33)
  Top 0.381: 1RF.1 3.94,35.56 4.44,35.56 U$18.P$1 4.7,35.31 6.22,35.31 v6.22,26.92
  Bottom 0.381: 1_RFM12.ANT 14.86,26.16 8.51,26.16 1_RFM69.ANA 8.25,26.42 6.73,26.42 v6.22,26.92
1_AREF  (via drill 0.33)
  Top 0.152: v38.48,12.95 38.48,8.13 41.28,5.33 45.85,5.33 45.85,6.35 45.85,7.11 48.64,9.91 v49.4,9.91
  Bottom 0.152: v38.48,12.95 39.24,13.72 C107.1 | v49.4,9.91 51.18,9.91 51.69,10.41 51.69,14.48 50.67,14.48 50.67,15.24 1_ATMEGA328.20
1_D0_RX  (via drill 0.33)
  Top 0.152: v56.52,10.16 56.52,11.18 57.02,11.68 58.04,11.68 58.04,10.67 58.55,10.16 59.05,10.16 63.12,14.22 63.12,17.53 64.9,19.3 v64.9,28.96
  Bottom 0.152: v56.52,10.16 55.25,10.16 1_ATMEGA328.30 | v64.9,28.96 65.15,29.21 71.75,29.21 73.02,30.48 FTDI.4
1_D1_TX  (via drill 0.33)
  Top 0.152: v59.05,11.18 62.36,14.48 v62.36,20.57
  Bottom 0.152: v59.05,11.18 57.28,9.4 55.25,9.4 1_ATMEGA328.31 | v62.36,20.57 62.36,26.67 71.75,26.67 73.02,27.94 FTDI.5
1_D2_IRQ  (via drill 0.33)
  Top 0.152: v53.98,8.64 51.18,11.43 51.18,19.56 50.67,20.07 v50.67,39.88 | v35.69,40.13 34.16,38.61 34.16,36.83 v34.42,36.58
  Bottom 0.152: v53.98,8.64 54.74,8.64 54.99,8.38 1_ATMEGA328.32 | v50.67,39.88 50.42,40.13 v35.69,40.13 | v34.42,36.58 34.16,36.32 30.86,36.32 1_RFM12.IRQ 30.61,36.32 28.07,36.32 1_RFM69.DIO0
1_D3_RELAIS_S1  (via drill 0.33)
  Top 0.152: v54.74,6.1 56.01,4.83 56.01,1.52 55.5,1.02 35.94,1.02 v35.94,6.86 | v28.07,9.65 27.81,9.91 27.81,19.81 27.3,20.32 27.3,28.19 25.53,29.97 25.53,31.5 IC2.4
  Bottom 0.152: v54.74,6.1 54.48,5.84 52.96,5.84 52.96,6.86 1_ATMEGA328.2 | v35.94,6.86 35.69,7.11 31.37,7.11 28.83,9.65 v28.07,9.65
1_D5_RELAIS_R2  (via drill 0.33)
  Top 0.152: v26.54,9.91 26.8,9.65 26.8,8.13 22.99,4.32 19.18,4.32 19.18,15.49 17.14,17.53 v17.14,22.1 | v25.78,26.42 25.78,27.94 24,29.72 24,31.5 IC2.3
  Bottom 0.152: v26.54,9.91 27.81,11.18 41.53,11.18 44.07,8.64 46.1,8.64 46.36,8.38 1_ATMEGA328.9 | v17.14,22.1 20.45,25.4 24.76,25.4 v25.78,26.42
1_D6_OC0A  (via drill 0.33)
  Top 0.152: v44.32,9.4 41.78,9.4 41.78,9.91 39.24,12.45 39.24,14.99 v37.47,16.76 | v33.4,16.76 32.13,18.03 v32.13,23.11 | v23.75,23.11 23.24,23.62 23.24,29.46 21.72,30.99 21.72,31.5 IC2.1
  Bottom 0.152: v44.32,9.4 46.36,9.4 1_ATMEGA328.10 | v33.4,16.76 v37.47,16.76 | v23.75,23.11 v32.13,23.11
1_D7_RELAIS_S2  (via drill 0.33)
  Top 0.152: v36.45,10.41 34.16,12.7 34.16,20.83 v32.89,22.1 | v24.26,22.35 24.51,22.61 24.51,27.18 23.75,27.94 23.75,29.46 22.99,30.23 22.99,31.5 IC2.2
  Bottom 0.152: v36.45,10.41 40.77,10.41 43.31,7.87 47.62,7.87 47.62,9.4 47.12,9.91 46.61,9.91 1_ATMEGA328.11 | v32.89,22.1 32.64,22.35 v24.26,22.35
1_D8_FLASH_SS  (via drill 0.33)
  Top 0.152: R5.2 13.08,38.1 11.3,38.1 11.3,37.34 9.52,37.34 9.52,30.23 10.79,28.96 10.79,28.45 U$11.1_CS 11.05,28.19 11.05,27.43 v13.34,25.15 | v36.45,12.19 36.7,12.45 36.7,23.11 35.43,24.38 v35.43,25.65
  Bottom 0.152: v36.45,12.19 36.96,11.68 41.53,11.68 42.29,10.92 46.36,10.92 1_ATMEGA328.12 | v35.43,25.65 35.18,25.91 33.15,25.91 31.88,27.18 25.53,27.18 24.26,25.91 16.89,25.91 16.13,25.15 v13.34,25.15
1_D10_SS  (via drill 0.33)
  Top 0.152: v9.52,38.1 10.54,38.1 R4.2 | v41.02,12.45 39.75,12.45 39.75,15.49 v38.48,16.76 | v8.76,22.86 6.99,24.64 v6.99,37.34
  Bottom 0.152: v41.02,12.45 46.36,12.45 1_ATMEGA328.14 | v38.48,16.76 37.47,17.78 24.76,17.78 21.72,20.83 10.79,20.83 v8.76,22.86 | v6.99,37.34 8,36.32 8.25,36.32 1_RFM69.NSS 8.51,36.32 9.52,36.32 v9.52,38.1 14.86,38.1 1_RFM12.SEL
1_D11_MOSI  (via drill 0.33)
  Top 0.152: v36.2,24.64 36.2,24.13 39.24,21.08 39.24,18.54 42.04,15.75 42.55,15.24 42.55,13.21 v44.58,13.21 | v33.4,24.89 31.37,26.92 v31.37,29.46 | 17.14,28.45 15.37,28.45 15.37,32.77 14.86,33.27 U$11.5_SI | 17.14,28.45 v17.65,28.45 | v28.57,27.94 28.57,21.59 29.85,20.32 29.85,3.56 31.62,1.78 ISP.4 | v16.64,33.78 17.14,33.27 17.14,28.45
  Bottom 0.152: 1_RFM69.MOSI 8.51,34.04 14.86,34.04 1_RFM12.SDI 15.11,34.04 15.37,33.78 v16.64,33.78 | v44.58,13.21 46.36,13.21 1_ATMEGA328.15 | v36.2,24.64 35.94,24.89 v33.4,24.89 | v31.37,29.46 31.11,29.21 29.34,29.21 28.32,28.19 | 28.32,28.19 28.07,27.94 25.78,27.94 25.27,28.45 v17.65,28.45 | 28.32,28.19 v28.57,27.94
1_D12_MISO  (via drill 0.33)
  Top 0.152: v45.09,13.97 45.59,13.46 45.59,9.14 45.09,9.14 42.8,6.86 42.55,6.86 v42.31,6.86 | v27.81,3.05 28.83,4.06 28.83,10.16 v28.57,10.41 28.32,10.67 28.32,21.34 27.81,21.84 v27.81,28.7 | v12.06,31.75 12.06,28.45 U$11.2_SO
  Bottom 0.152: v45.09,13.97 46.36,13.97 1_ATMEGA328.16 | v42.31,6.86 36.96,6.86 35.94,7.87 34.93,7.87 34.16,8.64 34.16,10.41 v28.57,10.41 | v27.81,3.05 29.08,1.78 ISP.1 | 12.06,33.02 20.45,33.02 21.46,34.04 | 12.06,33.02 9.27,33.02 8.51,32.26 1_RFM69.MISO | 21.46,34.04 26.54,39.12 29.85,39.12 30.61,38.35 1_RFM12.SDO | 12.06,33.02 v12.06,31.75 | v27.81,28.7 26.8,29.72 26.04,29.72 22.48,33.27 22.48,34.04 21.46,34.04
1_D13_SCK  (via drill 0.33)
  Top 0.152: v13.34,35.31 13.34,33.53 U$11.6_SCK 13.59,33.27 v13.59,31.24 | v38.48,14.73 37.21,13.46 37.21,9.14 36.45,8.38 | 36.45,8.38 32.89,4.83 v32.89,3.05 | v24.76,29.97 26.8,27.94 v26.8,12.19 | 36.45,8.38 v32.89,11.94
  Bottom 0.152: 1_RFM69.SCK 8.25,30.48 7.49,31.24 7.24,31.24 6.99,31.5 6.99,35.31 v13.34,35.31 14.1,35.31 14.86,36.07 1_RFM12.SCK | v38.48,14.73 47.37,14.73 47.88,15.24 1_ATMEGA328.17 | v32.89,3.05 31.62,1.78 ISP.3 | v13.59,31.24 23.5,31.24 v24.76,29.97 | v26.8,12.19 27.05,11.94 v32.89,11.94
1_RTS  (via drill 0.33)
  Top 0.152: v64.9,13.72 66.67,15.49 66.67,17.53 66.93,17.78 v67.07,17.78
  Bottom 0.152: v64.9,13.72 62.61,11.43 C104.2 | FTDI.6 73.02,25.4 67.94,25.4 67.94,19.56 67.18,18.8 67.18,17.78 v67.07,17.78
+3V3  (via drill 0.33)
  Top 0.356: v55.5,6.86 53.98,6.86 53.98,3.56 53.72,3.3 51.18,3.3 v51.18,8.13 v49.66,8.13 | U$11.7_HOLD 12.06,33.53 11.05,33.53 U$11.8_VCC 10.79,33.53 10.79,36.32 R4.1 10.79,36.58 13.08,36.58 R5.1 13.34,36.58 14.1,35.81 14.1,35.05 15.88,35.05 | v17.4,37.34 18.41,36.32 RELAY_SUPPLY.3 | 15.88,35.05 v16.38,35.05 | v16.38,29.21 15.88,29.72 15.88,35.05 | 25.02,20.57 v24,20.57 22.99,20.57 C4.1 22.73,20.32 22.73,19.81 19.94,19.81 3.3V_SUPPLY.2 | 25.02,20.57 C5.1 25.02,20.57 | ISP.2 29.34,1.52 ISP.2 | v33.4,12.95 31.37,14.99 v31.37,23.88 | v29.08,19.3 29.34,19.05 29.34,1.78 ISP.2 | 25.02,20.57 v25.02,27.69 | v46.61,15.49 v47.88,14.22 | v41.28,15.49 40.77,14.99 v40.77,13.46
  Bottom 0.356: 48.9,14.73 49.66,13.97 51.18,13.97 51.18,11.43 50.67,10.92 48.64,10.92 48.64,9.4 48.9,9.14 49.66,9.14 v49.66,8.13 49.66,7.11 1_ATMEGA328.6 | 48.9,14.73 48.9,15.24 1_ATMEGA328.18 | v55.5,6.86 61.85,6.86 61.85,9.65 60.32,11.18 R102.1 | v51.18,8.13 51.18,7.11 1_ATMEGA328.4 | v17.4,37.34 17.4,35.05 v16.38,35.05 | 15.88,28.96 16.13,29.21 v16.38,29.21 | 15.88,28.96 15.11,28.19 1_RFM12.VDD | 36.7,13.21 36.45,12.95 v33.4,12.95 | 36.7,13.21 37.21,13.72 C106.1 | 1_RFM69.VDD 28.07,24.13 31.11,24.13 v31.37,23.88 33.66,23.88 33.66,21.59 33.4,21.34 31.11,21.34 v29.08,19.3 25.27,19.3 v24,20.57 | 15.88,28.96 17.14,27.69 v25.02,27.69 | 48.9,14.73 48.39,14.22 v47.88,14.22 | v41.28,15.49 v46.61,15.49 | v40.77,13.46 39.5,12.19 37.72,12.19 36.7,13.21
BAT+  (via drill 0.33)
  Top 0.356: v35.18,8.64 33.4,6.86 v30.61,6.86
  Bottom 0.356: U$27.P 6.22,3.3 5.46,2.54 3.17,2.54 2.92,2.79 2.92,8.64 17.14,8.64 BATTTERY_AA.PWR@1 17.4,8.64 19.43,6.6 25.53,6.6 26.04,7.11 30.35,7.11 v30.61,6.86 | v35.18,8.64 40.01,8.64 BAT1.PWR@1
GND  (via drill 0.33)
  Top 0.356: v22.48,23.11 22.48,24.13 C6.2 | v30.61,24.89 30.61,31.5 IC2.8 | v3.94,39.88 3.94,38.35 1RF.G@1 | v13.08,29.97 14.61,29.97 14.61,28.45 U$11.4_GND 14.61,28.19 14.1,27.69 v14.1,24.38 | C4.2 22.99,18.8 25.02,18.8 C5.2 25.27,18.8 25.27,13.72 v26.04,12.95 | v53.21,17.02 53.21,19.56 VCC.2 | 34.42,1.52 ISP.6 34.42,1.78 35.18,2.54 v35.18,4.06 | 53.21,7.11 v52.2,8.13 | v53.21,4.06 53.21,7.11 | 70.74,19.81 71.25,20.32 IR/RELAY_SATELLITE.GND3 | 70.74,19.81 70.23,19.3 | 53.21,7.11 53.72,7.62 56.52,7.62 56.52,2.29 56.77,2.03 67.44,2.03 67.44,8.64 BATTTERY_AA.GND@1 67.69,8.64 BAT1.GND@1 67.44,8.89 67.44,11.43 67.18,11.68 POWER_JACK.3 67.18,11.94 69.47,14.22 69.47,18.54 69.98,19.05 | 70.74,19.81 70.74,38.1 73.02,38.1 FTDI.1 | 70.74,19.81 IR/RELAY_SATELLITE.GND3 | 70.23,19.3 69.98,19.05 | 70.23,19.3 IR/RELAY_SATELLITE.GND3 | 69.98,19.05 IR/RELAY_SATELLITE.GND3 | 1RF.G@4 3.68,32.77 3.68,20.57 IR/RELAY_SATELLITE.GND2 3.68,20.32 9.78,20.32 | 12.06,14.99 12.83,14.99 C2.2 | 12.06,14.99 11.3,14.99 | 11.3,14.99 11.05,14.99 C1.2 11.3,14.99 | 11.3,14.99 11.3,16.76 | 11.3,16.76 11.3,18.8 C3.2 | 12.06,10.67 13.08,10.67 U$2.2 | 12.06,14.99 12.06,10.67 | 9.78,20.32 9.27,19.81 9.27,18.8 11.3,16.76 | 9.78,20.32 10.03,20.57 10.03,20.83 11.05,20.83 IC1.1 | 12.57,6.6 12.57,3.56 IR/RELAY_SATELLITE.GND | 12.57,6.6 12.57,7.37 R1.2 | 12.57,6.6 12.06,6.6 | 12.06,6.6 8.76,6.6 7.49,7.87 USB.GND | 12.06,6.6 12.06,10.67
  Bottom 0.356: 30.61,25.91 30.86,25.91 1_RFM12.GND1 30.61,25.91 | 30.61,25.91 27.3,25.91 26.29,24.89 24.26,24.89 v22.48,23.11 20.7,21.34 16.64,21.34 13.59,24.38 | 30.61,25.91 v30.61,24.89 | v3.94,39.88 3.94,38.35 1RF.G@1 3.94,38.1 5.97,38.1 5.97,35.05 3.94,33.02 1RF.G@4 3.68,32.77 3.68,29.46 2.16,29.46 0.63,27.94 0.63,20.57 3.43,20.57 IR/RELAY_SATELLITE.GND2 | v13.08,29.97 14.86,29.97 1_RFM12.GND | 4.7,20.57 8.25,24.13 1_RFM69.GND 8.51,24.38 13.59,24.38 | 4.7,20.57 3.68,20.57 IR/RELAY_SATELLITE.GND2 | 13.59,24.38 v14.1,24.38 | 18.67,11.18 18.67,9.91 20.19,8.38 C8.2 20.45,8.13 21.21,7.37 22.99,7.37 22.99,9.4 24.26,10.67 24.76,10.67 R7.2 25.02,10.92 26.04,10.92 v26.04,12.95 30.86,12.95 31.37,13.46 31.37,14.48 32.39,15.49 R104.2 32.64,15.75 34.42,15.75 C105.2 34.67,15.75 37.21,15.75 C106.2 37.47,15.75 39.24,15.75 C107.2 39.5,15.75 40.77,17.02 51.18,17.02 | 18.67,11.18 19.68,11.18 U1.2 | 18.67,11.18 18.67,11.68 | 18.67,11.68 18.67,12.7 20.19,14.22 C7.2 | 51.18,17.02 51.18,15.49 1_ATMEGA328.21 | 51.18,17.02 v53.21,17.02 67.94,17.02 71.25,20.32 IR/RELAY_SATELLITE.GND3 | FTDI.1 73.02,38.35 71.75,39.62 64.64,39.62 62.61,37.59 IR/RELAY_SATELLITE.GND1 | 51.94,8.13 51.94,7.11 1_ATMEGA328.3 | 51.94,8.13 51.94,8.64 51.69,8.89 50.42,8.89 50.42,7.11 1_ATMEGA328.5 | 40.26,3.81 39.75,3.3 C100.2 | 53.21,3.81 53.47,3.81 53.98,3.3 C101.2 | 53.21,3.81 40.26,3.81 | v52.2,8.13 51.94,8.13 | 53.21,3.81 v53.21,4.06 | v35.18,4.06 35.43,3.81 40.26,3.81 | POWER_JACK.2 70.23,6.86 68.45,8.64 67.69,8.64 BAT1.GND@1 | 4.7,20.57 4.7,12.95 8,12.95 9.27,11.68 18.67,11.68 | 4.7,20.57 IR/RELAY_SATELLITE.GND2
  other vias: 19.64,38.18 19.34,29.88 15.64,22.08 15.44,17.38 21.64,16.98 47.04,2.78 72.04,1.58 44.24,17.68 65.54,16.58 70.14,27.78 43.14,3.88 26.14,1.88 23.24,7.48 25.64,4.58 31.34,12.68 37.74,7.58 39.46,17.27 41.76,19.27 46.76,17.27 15.76,20.07 25.96,25.07 21.74,29.48 11.14,25.18 23.74,39.38 52.14,34.28 57.14,14.38 50.14,11.78 50.24,3.88 37.34,1.98 30.68,9.66 48.04,11.68 64.84,18.28 61.64,15.48 3.94,5.68 11.24,30.18 10.84,31.78 59.04,6.08 58.04,7.98 65.04,9.98 41.74,13.18 43.54,13.88 43.54,11.78 43.56,10.17 47.04,7.08 41.96,7.87 34.46,23.07 33.06,19.77 34.86,19.27
  pour Bottom: -2.24,44.57 84.76,44.57 84.76,-5.43 -2.24,-5.43
  pour Top: -1.24,43.57 82.76,43.57 82.76,-4.43 -1.24,-4.43
  pour Top: -1.24,43.57 82.76,43.57 82.76,-4.43 -1.24,-4.43
N$1  (via drill 0.33)
  Top 0.152: v48.64,8.13 49.15,7.62 49.15,2.79 Q100.1
  Bottom 0.152: C101.1 53.98,1.52 52.96,2.54 49.4,2.54 Q100.1 | v48.64,8.13 48.64,7.11 1_ATMEGA328.7
N$2
  Top 0.152: R1.1 11.05,7.62 10.79,7.87 10.79,9.4 U$2.5
N$3  (via drill 0.33)
  Top 0.356: v9.27,27.69 8.25,27.69 R3.2
  Bottom 0.356: v9.27,27.69 9.02,27.94 5.21,27.94 4.95,27.69 IR-LED.A
N$4  (via drill 0.33)
  Top 0.356: v21.72,33.27 21.72,37.59 IC2.16
  Bottom 0.356: v21.72,33.27 20.45,32 13.08,32 12.83,31.75 12.83,30.99 | 12.83,30.73 12.83,30.99 | IR-LED.K 2.41,27.69 3.43,28.7 9.27,28.7 10.29,29.72 10.29,30.99 12.83,30.99
N$5  (via drill 0.33)
  Top 0.356: v22.48,39.37 22.48,38.1 22.73,37.85 IC2.15 | v9.52,39.37 8.76,38.61 8.76,30.23 10.03,28.96 10.03,22.1 v9.27,21.34 | v23.75,17.78 24.51,17.02 24.51,13.21 27.3,10.41 v27.3,6.35 | v44.07,6.1 49.15,11.18 49.15,16.76 46.86,19.05 46.86,29.21 45.59,30.48 K1.5
  Bottom 0.356: v9.52,39.37 v22.48,39.37 | v9.27,21.34 11.3,19.3 22.22,19.3 v23.75,17.78 | v27.3,6.35 27.56,6.1 v44.07,6.1
N$6  (via drill 0.33)
  Top 0.356: v24.51,36.07 24.51,37.34 24.26,37.59 IC2.14 | v41.28,34.29 v36.2,34.29 | v45.09,34.54 45.59,35.05 45.59,38.1 K1.6
  Bottom 0.356: v24.51,36.07 26.54,34.04 28.57,34.04 29.59,33.02 33.15,33.02 34.42,34.29 v36.2,34.29 | v41.28,34.29 41.53,34.54 v45.09,34.54
N$7  (via drill 0.33)
  Top 0.152: v47.12,6.1 44.58,3.56 44.58,2.79 Q100.2
  Bottom 0.152: C100.1 39.75,1.52 40.77,2.54 44.32,2.54 Q100.2 | v47.12,6.1 47.88,6.86 1_ATMEGA328.8
N$8  (via drill 0.33)
  Top 0.152: v14.86,5.59 14.1,6.35 14.1,8.64 13.34,9.4 U$2.1 | v38.48,3.05 43.56,3.05 43.56,2.29 44.07,1.78 v55.25,1.78
  Bottom 0.152: v14.86,5.59 15.11,5.84 25.53,5.84 27.56,3.81 34.42,3.81 35.18,3.05 v38.48,3.05 | v55.25,1.78 57.28,3.81 70.99,3.81 73.53,3.81 73.53,6.6 73.53,14.48 LED.K
N$9  (via drill 0.33)
  Top 0.356: v10.03,19.3 10.03,19.56 10.29,19.81 11.81,19.81 12.83,20.83 IC1.2 | v21.21,18.54 19.94,18.54 19.94,18.29 3.3V_SUPPLY.3
  Bottom 0.356: v10.03,19.3 10.79,18.54 v21.21,18.54
N$10
  Bottom 0.508: K2.3 40.51,20.83 42.8,23.11 49.15,23.11 U$24.1
N$11
  Bottom 0.152: R2.2 68.71,14.73 70.74,14.73 LED.A
N$12  (via drill 0.33)
  Top 0.508: v44.58,36.58 43.31,35.31 43.31,30.99 43.05,30.73 K1.4 | v46.61,36.58 47.62,35.56 47.62,32 49.15,30.48 U$22.2
  Bottom 0.508: v46.61,36.58 v44.58,36.58
N$13
  Bottom 0.508: K1.8 40.51,38.1 43.05,35.56 49.15,35.56 U$21.1
N$14
  Top 0.508: K1.7 43.05,38.35 44.58,39.88 49.15,39.88 49.15,38.35 U$21.2
N$15  (via drill 0.33)
  Top 0.356: v25.27,33.27 25.27,37.59 IC2.13 | v28.07,29.72 29.85,27.94 29.85,21.08 30.61,20.32 v30.61,19.56
  Bottom 0.356: v25.27,33.27 25.27,31.24 25.53,31.24 26.54,30.23 27.56,30.23 v28.07,29.72 | v30.61,19.56 31.88,18.29 43.05,18.29 45.34,20.57 K2.5
N$16  (via drill 0.33)
  Top 0.356: v26.29,33.27 26.29,37.34 26.54,37.59 IC2.12 | v41.53,33.27 v35.94,33.27 | v44.32,33.78 44.32,29.46 45.34,28.45 K2.6
  Bottom 0.356: v26.29,33.27 26.29,31.5 26.8,30.99 32.13,30.99 34.42,33.27 v35.94,33.27 | v41.53,33.27 42.04,33.78 v44.32,33.78
N$17
  Bottom 0.508: K2.8 40.51,28.19 43.31,25.4 49.15,25.4 U$23.1
N$18  (via drill 0.33)
  Top 0.508: v50.17,12.95 50.17,19.3 49.4,20.07 U$24.2 | K2.4 43.05,20.57 45.59,18.03 45.59,14.99 46.36,14.22 46.36,13.21 47.88,13.21 v48.03,13.05
  Bottom 0.508: v50.17,12.95 48.13,12.95 v48.03,13.05
N$19
  Bottom 0.508: K2.7 43.05,28.19 44.58,26.67 47.88,26.67 49.15,27.94 U$23.2
N$20
  Bottom 0.508: K1.3 40.51,30.73 42.55,32.77 48.9,32.77 49.15,33.02 U$22.1
N$21
  Bottom 0.508: VCC_RELAIS_101.1 38.73,32.77 38.73,30.73 37.97,30.73 K1.2
N$23  (via drill 0.33)
  Top 0.356: K1.1 35.43,30.48 35.43,28.45 K2.10 35.18,28.19 35.18,27.43 34.67,26.92 34.67,26.67 34.16,26.67 | 16.64,40.13 9.02,40.13 8,39.12 8,29.46 R3.1 | 16.64,40.13 16.64,36.07 17.91,34.8 18.41,34.8 RELAY_SUPPLY.2 | 16.64,40.13 29.08,40.13 30.1,39.12 30.1,38.1 30.35,37.85 IC2.9 30.61,37.59 30.61,37.34 v32.39,37.34 32.39,34.54 32.64,34.29 32.64,26.67 34.16,26.67 | 35.26,22.1 35.26,23.58 34.16,24.38 34.16,26.67 | 35.26,22.1 35.26,22.05 | K2.1 35.18,20.83 35.18,22.1 35.26,22.1
  Bottom 0.356: v32.39,37.34 34.42,37.34 35.18,38.1 K1.10
N$24
  Bottom 0.508: VCC_RELAIS_103.1 38.73,22.86 38.73,20.83 37.97,20.83 K2.2
N$25
  Bottom 0.508: VCC_RELAIS_100.1 38.73,35.81 38.73,38.1 37.97,38.1 K1.9
N$26
  Bottom 0.508: VCC_RELAIS_102.2 38.73,25.91 38.73,28.19 37.97,28.19 K2.9
N$27  (via drill 0.33)
  Top 0.356: v20.95,9.65 19.94,8.64 v19.94,5.08
  Bottom 0.356: v20.95,9.65 20.7,9.65 19.94,10.41 U1.1 | v19.94,5.08 18.92,4.06 18.41,4.06 U$1.P$2
N$29
  Bottom 0.356: R6.2 25.02,13.72 25.02,12.7 R7.1 24.76,12.45 22.48,12.45 U1.4
SYS_RESET  (via drill 0.33)
  Top 0.152: v57.28,10.92 v57.28,2.79
  Bottom 0.152: C104.1 62.36,13.21 60.32,13.21 R102.2 60.07,12.95 59.82,12.95 57.79,10.92 v57.28,10.92 55.25,10.92 1_ATMEGA328.29 | v57.28,2.79 54.99,0.51 35.43,0.51 34.42,1.52 ISP.5
V_CHARGE_3.7V  (via drill 0.33)
  Top 0.356: v14.86,6.6 14.61,6.86 14.61,11.43 13.84,12.19 | 13.84,12.19 13.08,12.95 C2.1 | 13.84,12.19 13.34,11.68 U$2.3
  Bottom 0.356: v14.86,6.6 7.75,6.6 5.46,4.32 4.7,4.32 3.94,3.56 U$27.S
VCC  (via drill 0.33)
  Top 0.508: 21.21,25.91 22.22,25.91 C6.1 | 21.21,25.91 21.21,25.65 20.7,25.15 19.94,25.15 LOAD_SUPPLY.2 | 21.21,25.91 21.21,27.43 20.7,27.94 20.7,30.99 18.67,33.02 RELAY_SUPPLY.1 19.18,32.77 20.7,34.29 v20.7,34.54 | v33.91,27.69 33.91,31.24 v34.93,32.26 34.67,32.26 34.67,33.53 33.4,34.8 33.4,37.85 v31.37,39.88 | v43.56,22.1 39.24,22.1 39.24,23.37 v35.94,26.67
  Bottom 0.508: VCC_RELAIS_100.2 37.47,35.56 37.47,33.02 VCC_RELAIS_101.2 37.21,32.77 36.7,32.26 v34.93,32.26 | VCC_RELAIS_103.2 37.47,23.11 37.47,25.65 VCC_RELAIS_102.1 37.21,25.91 36.45,26.67 v35.94,26.67 34.93,26.67 v33.91,27.69 | v43.56,22.1 47.12,22.1 47.12,20.32 46.86,20.07 46.86,18.8 47.62,18.03 54.48,18.03 56.01,19.56 VCC.1 | v20.7,34.54 26.04,39.88 v31.37,39.88
VIN_1,4V_3.7V  (via drill 0.33)
  Top 0.356: 19.94,21.59 19.94,23.37 LOAD_SUPPLY.3 | 19.94,21.59 19.94,21.34 3.3V_SUPPLY.1 19.94,21.59 | 21.72,14.99 20.7,13.97 v20.7,13.21 | 21.72,14.99 v23.5,16.76 | v23.5,21.59 19.94,21.59 | v26.04,16.76 v26.04,21.59 | v22.48,5.08 21.72,5.84 21.72,14.99
  Bottom 0.356: 9.02,3.3 U$27.O 9.27,3.3 9.27,0.76 20.7,0.76 23.75,3.81 U$1.P$1 23.75,4.06 22.73,5.08 v22.48,5.08 | C8.1 22.22,8.38 22.22,10.41 U1.6 22.22,10.67 21.46,10.67 20.95,11.18 20.95,12.19 19.94,12.19 U1.3 19.94,12.45 v20.7,13.21 | v23.5,16.76 v26.04,16.76 29.08,16.76 30.1,15.75 R103.1 | v26.04,21.59 v23.5,21.59
VIN_5V_12V  (via drill 0.33, 0.6)
  Top 0.508: v64.39,14.73 63.88,14.22 63.88,7.11 64.13,6.86 POWER_JACK.1 | 14.35,19.05 13.08,19.05 C3.1 | 14.35,19.05 14.35,21.84 13.72,22.48 | 13.72,22.48 13.08,23.11 12.06,23.11 IC1.3 | v15.62,13.21 14.35,14.48 14.35,19.05 | LOAD_SUPPLY.1 19.68,26.42 15.11,26.42 15.11,23.88 13.84,22.61 13.72,22.48 | v9.52,12.95 10.54,12.95 C1.1 10.79,12.95 10.79,11.68 U$2.4 10.54,11.43 9.27,11.43 | v68.76,33.57 68.76,23.67 67.86,22.67 67.86,17.57 67.94,17.53 67.94,17.27 67.94,16.26 v67.69,16 | 9.27,11.43 7.49,11.43 USB.VBUS | v9.27,7.62 9.27,11.43 | v16.13,6.86 18.41,4.57 18.41,4.06 18.92,3.56 26.8,3.56 26.8,3.81 v27.81,4.83
  Bottom 0.508: PUMPED_VCC.2 17.14,12.95 16.89,13.21 v15.62,13.21 9.78,13.21 v9.52,12.95 | v68.76,33.57 72.76,33.57 FTDI.3 | v64.39,14.73 66.67,14.73 R2.1 67.18,14.99 67.18,16 v67.69,16 | v9.27,7.62 15.37,7.62 v16.13,6.86 | v27.81,4.83 28.07,5.08 62.61,5.08 64.13,6.6 POWER_JACK.1
VIN_PUMPED  (via drill 0.33)
  Top 0.356: LOAD_SUPPLY.4 18.16,24.89 18.16,19.81 3.3V_SUPPLY.4 18.16,19.56 v18.16,17.53 | v23.75,11.43 23.24,11.94 v23.24,13.21
  Bottom 0.356: 22.99,15.24 23.24,15.49 24.76,15.49 R6.1 | 22.99,15.24 22.22,14.48 C7.1 22.22,14.22 v23.24,13.21 | v23.75,11.43 22.48,11.43 U1.5 | 18.16,15.24 17.4,14.48 PUMPED_VCC.1 | 22.99,15.24 18.16,15.24 | 18.16,15.24 v18.16,17.53

### Text on the board
tNames: GND | VCC | TXD | RXD | DTR | GND | VCC | ADC1 | ADC2 | SDA | SDL | CR-BATTERY | AA-BATTERY | v1.0
bNames: SwitchPower | SwitchPower